# Altium project POVDisplay.PrjPcb
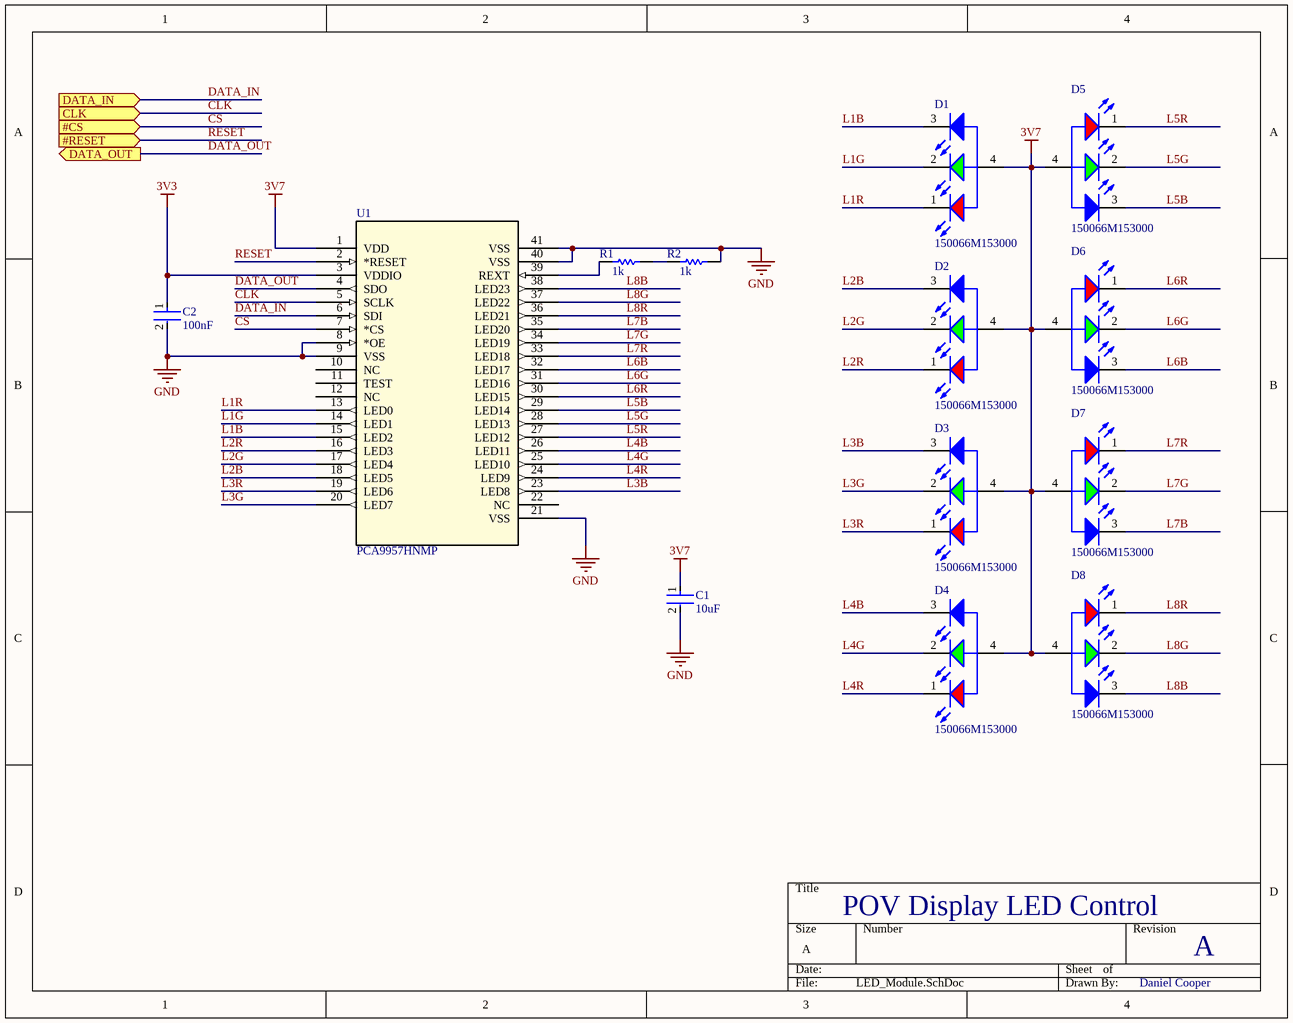
[diagram p0: LED_Module.SchDoc]
4 sheets, 53 parts. Net scope: hierarchical (ports join the sheet entries above them; power ports are global).
Board file: POVDisplay.PcbDoc
Sheets:
  LED_Module.SchDoc
  System.SchDoc
    MCU = MCU.SchDoc
    Power = Power.SchDoc

## Sheet LED_Module.SchDoc
size A; SheetNumber: 4; SheetTotal: 5

### Parts
(Parts that share a designator on the sheet are numbered #1, #2 ... from top to bottom, then left to right.)
C1#1  10uF  [FP-CL21-IPC_B]
C2#1  100nF  [FP-CL21-IPC_C]
D1  150066M153000  [WL-SFCD_0606]
D2  150066M153000  [WL-SFCD_0606]
D3  150066M153000  [WL-SFCD_0606]
D4  150066M153000  [WL-SFCD_0606]
D5  150066M153000  [WL-SFCD_0606]
D6  150066M153000  [WL-SFCD_0606]
D7  150066M153000  [WL-SFCD_0606]
D8  150066M153000  [WL-SFCD_0606]
R1#1  1k  [RESC2013X60X35ML10T20]
R2#1  1k  [RESC2013X60X35ML10T20]
U1  PCA9957HNMP  [HVQFN40_SOT1369-5_NXP]

### Ports
#CS (in), #RESET (in), CLK (in), DATA_IN (in), DATA_OUT (out)

### Nets
3V3: C2#1.1 U1.3(VDDIO)
3V7: C1#1.1 D1.4(A) D2.4(A) D3.4(A) D4.4(A) D5.4(A) D6.4(A) D7.4(A) D8.4(A) U1.1(VDD)
GND: C1#1.2 C2#1.2 R2#1.2 U1.8(*OE) U1.9(VSS) U1.21(VSS) U1.40(VSS) U1.41(VSS)
CLK: U1.5(SCLK) ; port CLK
CS: U1.7(*CS) ; port #CS
DATA_IN: U1.6(SDI) ; port DATA_IN
DATA_OUT: U1.4(SDO) ; port DATA_OUT
L1B: D1.3(K) U1.15(LED2)
L1G: D1.2(K) U1.14(LED1)
L1R: D1.1(K) U1.13(LED0)
L2B: D2.3(K) U1.18(LED5)
L2G: D2.2(K) U1.17(LED4)
L2R: D2.1(K) U1.16(LED3)
L3B: D3.3(K) U1.23(LED8)
L3G: D3.2(K) U1.20(LED7)
L3R: D3.1(K) U1.19(LED6)
L4B: D4.3(K) U1.26(LED11)
L4G: D4.2(K) U1.25(LED10)
L4R: D4.1(K) U1.24(LED9)
L5B: D5.3(K) U1.29(LED14)
L5G: D5.2(K) U1.28(LED13)
L5R: D5.1(K) U1.27(LED12)
L6B: D6.3(K) U1.32(LED17)
L6G: D6.2(K) U1.31(LED16)
L6R: D6.1(K) U1.30(LED15)
L7B: D7.3(K) U1.35(LED20)
L7G: D7.2(K) U1.34(LED19)
L7R: D7.1(K) U1.33(LED18)
L8B: D8.3(K) U1.38(LED23)
L8G: D8.2(K) U1.37(LED22)
L8R: D8.1(K) U1.36(LED21)
RESET: U1.2(*RESET) ; port #RESET
NetR1#1_1: R1#1.1 U1.39(REXT)
NetR1#1_2: R1#1.2 R2#1.1

Not connected (* = marked no-connect by the designer): U1 10(NC) 11(TEST) 12(NC) 22(NC)

### Notes on the sheet
- POV Display LED Control
- A
- Daniel Cooper

### Library data of the parts
C1#1 = CMP-2000-06102-2: CL21 Series 0805 10uF 16V ±10% Tolerance X5R Multilayer Ceramic Chip Capacitor; Dielectric: X7R; Length: 2mm; Depth: 1.25mm; Voltage: 16V; Width: 0.049inch; Capacitance: 10uF; Lead Free: Lead Free; Max Operating Temperature: 85°C; Mount: Surface Mount; Voltage Rating: 16V; Height: 1.25mm; Radiation Hardening: No; Packaging: Tape and Reel; Voltage Rating (DC): 16V; Thickness: 0.055inch; Case/Package: 0805; Case Code (Imperial): 0805; Min Operating Temperature: -55°C; Case Code (Metric): 2012; Package Quantity: 1; Tolerance: 10%
C2#1 = CMP-2000-05017-2: CL21 Series 0805 100nF 50V ±10% Tolerance X7R Multilayer Ceramic Chip Capacitor; Depth: 1.25mm; Height: 0.85mm; Width: 0.049inch; Tolerance: 10%; Case Code (Metric): 2012; Case Code (Imperial): 0805; Material: Ceramic; Thickness: 0.037inch; Min Operating Temperature: -55°C; Contact Plating: Tin; Length: 2mm; Mount: Surface Mount; Voltage Rating (DC): 50V; Lead Free: Lead Free; Dielectric: X7R; Radiation Hardening: No; Capacitance: 100nF; Voltage Rating: 50V; Case/Package: 0805; Packaging: Tape and Reel; Max Operating Temperature: 125°C; Voltage: 50V
D1-D8 = CMP-207942-000005-2: LED RGB DIFFUSED SMD; NexarPartId: 82270972; Peak Wavelength: 468nm; Reverse Voltage: 5V; Power Dissipation: 48mW; Forward Current: 40mA; Forward Voltage: 2V; Color: Blue, Green, Red; Viewing Angle: 120°; Dominant Wavelength: 525nm; Luminous Intensity: 180mcd; RoHS: Compliant; Width: 1.6mm; Min Operating Temperature: -40°C; Packaging: Tape and Reel; Max Operating Temperature: 85°C; Max Reverse Voltage (DC): 5V; Length: 1.6mm; Height: 400µm
R1#1 R2#1 = CMP-2100-03671-1: Chip Resistor, 1 KOhm, +/- 1%, 125 mW, -55 to 155 degC, 0805 (2012 Metric), RoHS, Tape and Reel; Manufacturer: Yageo; Temperature Coefficient: 100ppm/degreesC; Voltage Rating (DC): 150V; Max Power Dissipation: 125mW; Resistance: 1KOhm; Number of Pins: 2; Number of Terminations: 2; Datasheet URL: http://www.yageo.com/NewPortal/yageodocoutput?fileName=/pdf/R-Chip/PYu-RC_Group_51_RoHS_L_5.pdf; Length: 0.079inch; Package Description: 2-Pin Surface Mounted Device, Body 2 x 1.25 mm; Depth: 1.25mm; Height: 0.024inch; Military Standard: Not; Case/Package: 0805; Package Reference: 0805; RoHSCompliant: true; Lead Free: LeadFree; Packaging: TapeandReel; Package Quantity: 1; Datasheet Version: Rev. 5, 10/2016; Tolerance: 1%; Min Operating Temperature: -55degC; Voltage Rating: 150V; Composition: ThickFilm; Case Code (Imperial): 0805; Power Rating: 125mW; Width: 0.049inch; Case Code (Metric): 2012; Manufacturer URL: http://www.yageo.com/; Max Operating Temperature: 155degC; REACH SVHC: Unknown; Termination: SMD/SMT
U1 = PCA9957HNMP: No Description Available; Mfr_Name: NXP; RefDes: RefDes; Type: Type

## Sheet System.SchDoc
size A; SheetNumber: 1; SheetTotal: 5
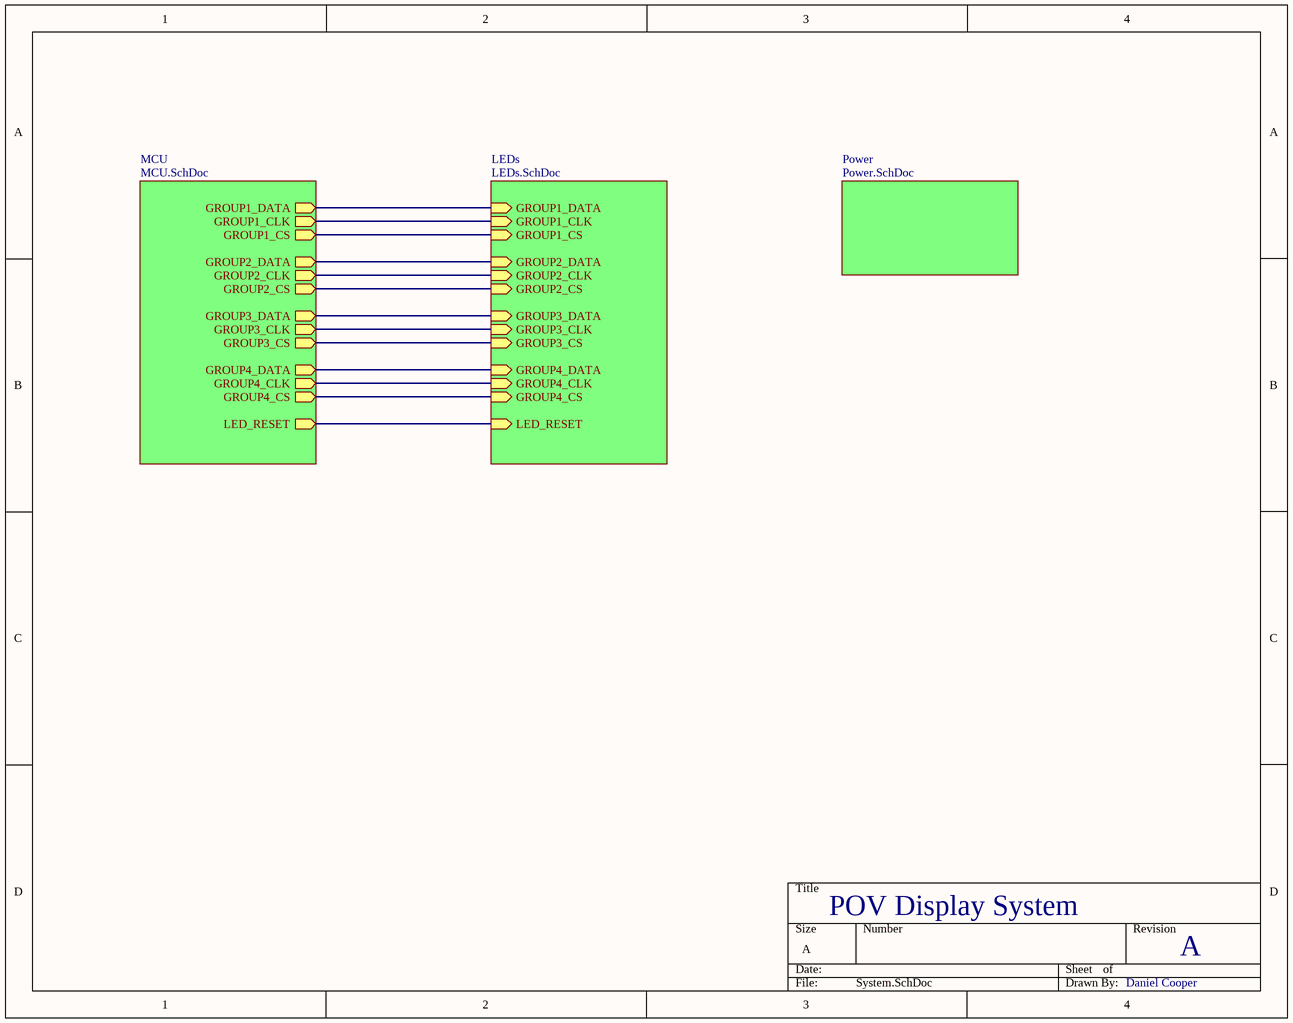
[diagram p1: System.SchDoc]

### Sub-sheets
LEDs = LEDs.SchDoc (file not in this document): LED_RESET (in), GROUP4_CS (in), GROUP4_CLK (in), GROUP4_DATA (in), GROUP3_CS (in), GROUP3_CLK (in), GROUP3_DATA (in), GROUP2_CS (in), GROUP2_CLK (in), GROUP2_DATA (in), GROUP1_CS (in), GROUP1_CLK (in), GROUP1_DATA (in)
MCU = MCU.SchDoc: GROUP1_DATA (out), GROUP1_CLK (out), GROUP1_CS (out), GROUP2_DATA (out), GROUP2_CLK (out), GROUP2_CS (out), GROUP3_DATA (out), GROUP3_CLK (out), GROUP3_CS (out), GROUP4_DATA (out), GROUP4_CLK (out), GROUP4_CS (out), LED_RESET (out)
Power = Power.SchDoc: no entries

### Nets
GROUP1_CLK: sheet MCU/GROUP1_CLK, sheet LEDs/GROUP1_CLK
GROUP1_CS: sheet MCU/GROUP1_CS, sheet LEDs/GROUP1_CS
GROUP1_DATA: sheet MCU/GROUP1_DATA, sheet LEDs/GROUP1_DATA
GROUP2_CLK: sheet MCU/GROUP2_CLK, sheet LEDs/GROUP2_CLK
GROUP2_CS: sheet MCU/GROUP2_CS, sheet LEDs/GROUP2_CS
GROUP2_DATA: sheet MCU/GROUP2_DATA, sheet LEDs/GROUP2_DATA
GROUP3_CLK: sheet MCU/GROUP3_CLK, sheet LEDs/GROUP3_CLK
GROUP3_CS: sheet MCU/GROUP3_CS, sheet LEDs/GROUP3_CS
GROUP3_DATA: sheet MCU/GROUP3_DATA, sheet LEDs/GROUP3_DATA
GROUP4_CLK: sheet MCU/GROUP4_CLK, sheet LEDs/GROUP4_CLK
GROUP4_CS: sheet MCU/GROUP4_CS, sheet LEDs/GROUP4_CS
GROUP4_DATA: sheet MCU/GROUP4_DATA, sheet LEDs/GROUP4_DATA
LED_RESET: sheet MCU/LED_RESET, sheet LEDs/LED_RESET

### Notes on the sheet
- POV Display System
- A
- Daniel Cooper

## Sheet MCU.SchDoc
size A; SheetNumber: 2; SheetTotal: 5
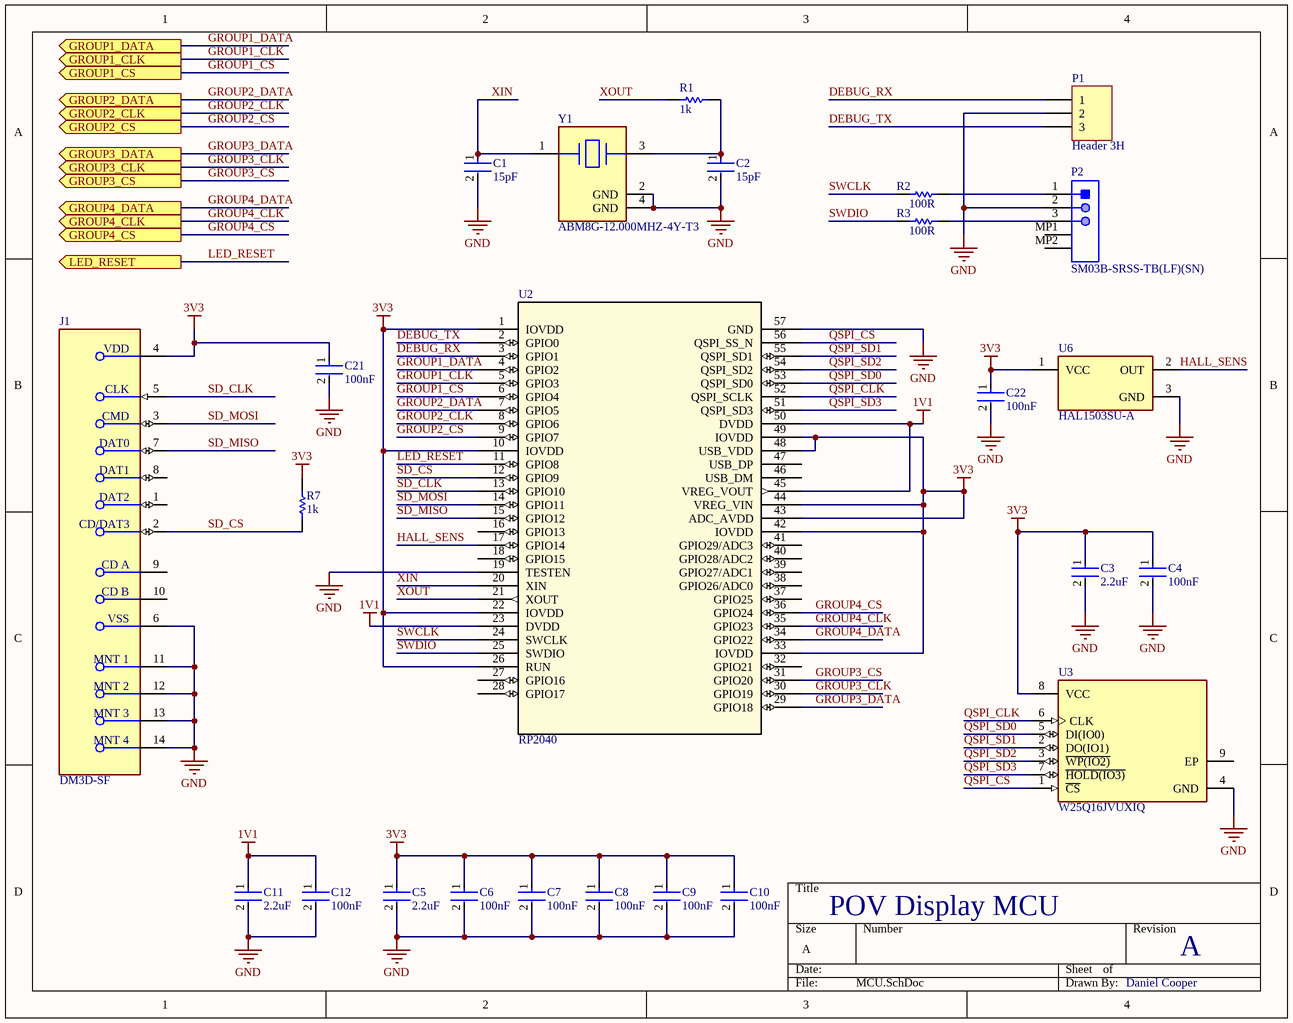
[diagram p2: MCU.SchDoc]

### Parts
(Parts that share a designator on the sheet are numbered #1, #2 ... from top to bottom, then left to right.)
C1#2  15pF  [FP-C0805C-DN-MFG]
C2#2  15pF  [FP-C0805C-DN-MFG]
C3  2.2uF  [FP-GRM21B-0_15-IPC_A]
C4  100nF  [FP-CL21-IPC_C]
C5  2.2uF  [FP-GRM21B-0_15-IPC_A]
C6  100nF  [FP-CL21-IPC_C]
C7  100nF  [FP-CL21-IPC_C]
C8  100nF  [FP-CL21-IPC_C]
C9  100nF  [FP-CL21-IPC_C]
C10  100nF  [FP-CL21-IPC_C]
C11  2.2uF  [FP-GRM21B-0_15-IPC_A]
C12  100nF  [FP-CL21-IPC_C]
C21  100nF  [FP-CL21-IPC_C]
C22  100nF  [FP-CL21-IPC_C]
J1  DM3D-SF  [FP-DM3D-SF-MFG]
P1  Header 3H  [HDR1X3H]
P2  SM03B-SRSS-TB(LF)(SN)  [JST-SM03B-SRSS-TB_V]
R1#2  1k  [RESC2013X60X35ML10T20]
R2#2  100R  [RESC2013X60X35ML10T20]
R3  100R  [RESC2013X60X35ML10T20]
R7  1k  [RESC2013X60X35ML10T20]
U2  RP2040  [IC57_RP2040]
U3  W25Q16JVUXIQ  [FP-UX-MFG]
U6  HAL1503SU-A  [FP-DBZ0003A-MFG]
Y1  ABM8G-12.000MHZ-4Y-T3  [FP-ABM8G-MFG]

### Ports
GROUP1_CLK (out), GROUP1_CS (out), GROUP1_DATA (out), GROUP2_CLK (out), GROUP2_CS (out), GROUP2_DATA (out), GROUP3_CLK (out), GROUP3_CS (out), GROUP3_DATA (out), GROUP4_CLK (out), GROUP4_CS (out), GROUP4_DATA (out), LED_RESET (out)

### Nets
1V1: C11.1 C12.1 U2.23(DVDD) U2.45(VREG_VOUT) U2.50(DVDD)
3V3: C3.1 C4.1 C5.1 C6.1 C7.1 C8.1 C9.1 C10.1 C21.1 C22.1 J1.4(VDD) R7.2 U2.1(IOVDD) U2.10(IOVDD) U2.22(IOVDD) U2.26(RUN) U2.33(IOVDD) U2.42(IOVDD) U2.43(ADC_AVDD) U2.44(VREG_VIN) U2.48(USB_VDD) U2.49(IOVDD) U3.8(VCC) U6.1(VCC)
GND: C1#2.2 C2#2.2 C3.2 C4.2 C5.2 C6.2 C7.2 C8.2 C9.2 C10.2 C11.2 C12.2 C21.2 C22.2 J1.6(VSS) J1.11(MNT_1) J1.12(MNT_2) J1.13(MNT_3) J1.14(MNT_4) P1.2 P2.2 U2.19(TESTEN) U2.57(GND) U3.4(GND) U6.3(GND) Y1.2(GND) Y1.4(GND)
DEBUG_RX: P1.1 U2.3(GPIO1)
DEBUG_TX: P1.3 U2.2(GPIO0)
GROUP1_CLK: U2.5(GPIO3) ; port GROUP1_CLK
GROUP1_CS: U2.6(GPIO4) ; port GROUP1_CS
GROUP1_DATA: U2.4(GPIO2) ; port GROUP1_DATA
GROUP2_CLK: U2.8(GPIO6) ; port GROUP2_CLK
GROUP2_CS: U2.9(GPIO7) ; port GROUP2_CS
GROUP2_DATA: U2.7(GPIO5) ; port GROUP2_DATA
GROUP3_CLK: U2.30(GPIO19) ; port GROUP3_CLK
GROUP3_CS: U2.31(GPIO20) ; port GROUP3_CS
GROUP3_DATA: U2.29(GPIO18) ; port GROUP3_DATA
GROUP4_CLK: U2.35(GPIO23) ; port GROUP4_CLK
GROUP4_CS: U2.36(GPIO24) ; port GROUP4_CS
GROUP4_DATA: U2.34(GPIO22) ; port GROUP4_DATA
HALL_SENS: U2.17(GPIO14) U6.2(OUT)
LED_RESET: U2.11(GPIO8) ; port LED_RESET
QSPI_CLK: U2.52(QSPI_SCLK) U3.6(CLK)
QSPI_CS: U2.56(QSPI_SS_N) U3.1(~{CS})
QSPI_SD0: U2.53(QSPI_SD0) U3.5(DI(IO0))
QSPI_SD1: U2.55(QSPI_SD1) U3.2(DO(IO1))
QSPI_SD2: U2.54(QSPI_SD2) U3.3(~{WP(IO2)})
QSPI_SD3: U2.51(QSPI_SD3) U3.7(~{HOLD(IO3)})
SD_CLK: J1.5(CLK) U2.13(GPIO10)
SD_CS: J1.2(CD/DAT3) R7.1 U2.12(GPIO9)
SD_MISO: J1.7(DAT0) U2.15(GPIO12)
SD_MOSI: J1.3(CMD) U2.14(GPIO11)
SWCLK: R2#2.1 U2.24(SWCLK)
SWDIO: R3.1 U2.25(SWDIO)
XIN: C1#2.1 U2.20(XIN) Y1.1
XOUT: R1#2.1 U2.21(XOUT)
NetC2#2_1: C2#2.1 R1#2.2 Y1.3
NetP2_1: P2.1 R2#2.2
NetP2_3: P2.3 R3.2

Not connected (* = marked no-connect by the designer): J1 1(DAT2) 8(DAT1) 9(CD_A) 10(CD_B); P2 MP1 MP2; U2 16(GPIO13) 18(GPIO15) 27(GPIO16) 28(GPIO17) 32(GPIO21) 37(GPIO25) 38(GPIO26/ADC0) 39(GPIO27/ADC1) 40(GPIO28/ADC2) 41(GPIO29/ADC3) 46(USB_DM) 47(USB_DP); U3 9(EP)

### Notes on the sheet
- POV Display MCU
- A
- Daniel Cooper

### Library data of the parts
C1#2 C2#2 = CMP-2007-00289-2: Cap Ceramic 15pF 50V C0G 5% SMD 0805 125C Plastic T/R; Manufacturer Part Number: C0805C150J5GACTU; Manufacturer: KEMET; Temperature Coefficient: 30ppm/°C; Tolerance: 0.05; Temperature Characteristic: C0G; Capacitance: 15 pF; Category: Cap; Voltage Rating: 50 V; Value: 15 pF; Lead Free: Yes; Material: Ceramic; Device Class L1: Passive Components; ComponentLink2Description: Datasheet; Temperature Range Low: -55°C; Ipc Land Pattern Name: CAPC200125X78; Automotive: No; Temperature: -55°C to +125°C; Digikey Description: Cap Ceramic 15pF 50V C0G 5% SMD 0805 125C Plastic T/R; Package: C0805C-DN; Temperature Range High: +125°C; Device Class L3: Ceramic Capacitors; Octopart: https://octopart.com/c0805c150j5gactu-kemet-97841; Height: 0.88mm; Mouser Description: Multilayer Ceramic Capacitors MLCC - SMD/SMT 50volts 15pF C0G 5%; ComponentLink2URL: https://content.kemet.com/datasheets/KEM_C1003_C0G_SMD.pdf; Device Class L2: Capacitors; RoHS: TRUE
C3 C5 C11 = CMP-06035-028354-1: Chip Multilayer Ceramic Capacitors for General Purpose, 0805, 2.2uF, X7R, 15%, 10%, 25V; Voltage Rating (DC): 25V; Thickness: 1.25mm; Dielectric: X7R; Tolerance: 10%; Length: 2mm; Width: 1.25mm; Capacitance: 2.2uF
C4 C6-C10 C12 C21 C22 = CMP-2000-05017-2: as C2#1 on sheet LED_Module; Depth: 1.25mm; Height: 0.85mm; Width: 0.049inch; Tolerance: 10%; Case Code (Metric): 2012; Case Code (Imperial): 0805; Material: Ceramic; Thickness: 0.037inch; Min Operating Temperature: -55°C; Contact Plating: Tin; Length: 2mm; Mount: Surface Mount; Voltage Rating (DC): 50V; Lead Free: Lead Free; Dielectric: X7R; Radiation Hardening: No; Capacitance: 100nF; Voltage Rating: 50V; Case/Package: 0805; Packaging: Tape and Reel; Max Operating Temperature: 125°C; Voltage: 50V
J1 = CMP-2000-06166-2: CONN MICRO SD CARD PUSH-PULL; Insulation Resistance: 1GR; Max Voltage Rating (AC): 125V; Gender: Female; Contact Resistance: 100mR; Current Rating: 500mA; Pitch: 1.1mm; Connector Type: Connector; Number of Contacts: 8; Contact Plating: Gold; Number of Rows: 1; Termination: Solder; Contact Material: Copper Alloy; REACH SVHC: No SVHC; Voltage Rating (AC): 125V; Packaging: Tape and Reel; Housing Material: Polymer; Max Operating Temperature: 85°C; Package Quantity: 1; Min Operating Temperature: -25°C; Lead Free: Lead Free; Orientation: Right Angle; Radiation Hardening: No; Flammability Rating: UL94 V-0; Mount: Surface Mount; Depth: 11.45mm; Max Current Rating: 500mA; Length: 11.95mm; Width: 11.95mm
P1 = Header 3H: Header, 3-Pin, Right Angle; LatestRevisionDate: 17-Jul-2002; LatestRevisionNote: Re-released for DXP Platform.; Publisher: Altium Limited
P2 = CMP-2000-07077-1: Male Header, Pitch 1 mm, 1 x 3 Position, Height 2.9 mm, -25 to 85 degC, RoHS, Tape and Reel; Manufacturer: JST; Pitch: 1mm; Style/Orientation: RightAngleHeader/Plug; No of Positions: 3; Package Description: Male Header, Pitch 1 mm, 1 x 3 Position, Height 2.9 mm; Manufacturer URL: http://www.jst.com/home2.html; Package Reference: SM03B-SRSS-TB; Type: ShroudedHeader; Termination: Crimp; Mounting Technology: SurfaceMount; Datasheet Version: 11/2010; Datasheet URL: https://datasheet.ciiva.com/26894/getdatasheetpartid-708885-26894671.pdf
R1#2 R7 = CMP-2100-03671-1: as R1#1 on sheet LED_Module; Number of Pins: 2; Number of Terminations: 2; Datasheet URL: http://www.yageo.com/NewPortal/yageodocoutput?fileName=/pdf/R-Chip/PYu-RC_Group_51_RoHS_L_5.pdf; Length: 0.079inch; Package Description: 2-Pin Surface Mounted Device, Body 2 x 1.25 mm; Depth: 1.25mm; Height: 0.024inch; Military Standard: Not; Case/Package: 0805; Package Reference: 0805; RoHSCompliant: true; Lead Free: LeadFree; Packaging: TapeandReel; Package Quantity: 1; Datasheet Version: Rev. 5, 10/2016; Tolerance: 1%; Min Operating Temperature: -55degC; Voltage Rating: 150V; Composition: ThickFilm; Case Code (Imperial): 0805; Power Rating: 125mW; Width: 0.049inch; Case Code (Metric): 2012; Manufacturer URL: http://www.yageo.com/; Max Operating Temperature: 155degC; REACH SVHC: Unknown; Termination: SMD/SMT
R2#2 R3 = CMP-2100-03669-1: Chip Resistor, 100 Ohm, +/-1%, 0.125 W, -55 to 155 degC, 0805 (2012 Metric), RoHS, Tape and Reel; Manufacturer: Yageo; Power Rating: 125mW; Resistance: 100Ohm; Voltage Rating: 150V; Tolerance: 1%; Temperature Coefficient: 100ppm/degreesC; Length: 2mm; Package Description: 2-Pin Surface Mounted Device, Body 2 x 1.25 mm; Case Code (Imperial): 0805; Number of Pins: 2; Termination: SMD/SMT; Lead Pitch: 0.4mm; Package Quantity: 1; Height: 0.024inch; Case Code (Metric): 2012; Number of Terminations: 2; Datasheet Version: Rev. 5, 10/2016; Lead Free: LeadFree; Package Reference: 0805; Composition: ThickFilm; REACH SVHC: Unknown; Voltage Rating (DC): 150V; Min Operating Temperature: -55degC; Packaging: TapeandReel; Military Standard: Not; Case/Package: 0805; Datasheet URL: http://www.yageo.com/NewPortal/yageodocoutput?fileName=/pdf/R-Chip/PYu-RC_Group_51_RoHS_L_5.pdf; Max Operating Temperature: 155degC; Manufacturer URL: http://www.yageo.com/; Max Power Dissipation: 125mW; Width: 0.049inch; Depth: 1.25mm; RoHSCompliant: true
U2 = RP2040: No Description Available; Mfr_Name: Raspberry Pi; RefDes: RefDes; Type: Type
U3 = CMP-78876-000011-1: IC FLASH 16MBIT SPI/QUAD 8USON; RoHS Compliant: Yes
U6 = CMP-04937-000003-1: LP HALL 32FBDBZR; Manufacturer Part Number: DRV5032FBDBZR; Manufacturer: Texas Instruments; Standoff Height: 0.01mm; Output Voltage: 5.5V; Max Junction Temp: +105°C; Output Current: 5mA; Sensor Output: Analog Voltage; Min Supply Voltage: 1.65V; Operating Supply Current: 1.06uA; Sensing Method: Hall Effect; Device Class L3: unset; Digikey Description: LP HALL 32FBDBZR; Ambient Temperature Range High: +85°C; Max Supply Voltage: 5.5V; Octopart: https://octopart.com/drv5032fbdbzr-texas+instruments-81717203; Lead Free: Yes; RoHS: TRUE; Mouser Description: Hall Effect Sensor 5mA Omnipolar 1.8V/2.5V/3.3V/5V 3-Pin SOT-23 T/R; ComponentLink2Description: Datasheet; Package: DBZ0003A; Device Class L2: Magnetic Sensors; Automotive: No; Temperature: -40°C to +85°C; Temperature Range Low: -40°C; Category: IC; Temperature Range High: +85°C; Device Class L1: Sensors; ComponentLink2URL: http://www.ti.com/lit/ds/symlink/drv5032.pdf; Ambient Temperature Range Low: -40°C; Height: 1.12mm
Y1 = CMP-27762-014577-1: Crystal 12MHz ±30ppm (Tol) ±30ppm (Stability) 10pF FUND 120Ω 4-Pin SMD T/R; ESR (Equivalent Series Resistance): 120R; Height: 0.039inch; Load Capacitance: 10pF; Operating Frequency: 12 MHz; REACH SVHC: No SVHC; Series: ABM8G; Series Resistance: 120R; Width: 0.098inch; Case/Package: CSMD; Min Operating Temperature: -10°C; Frequency: 12MHz; Mount: Surface Mount; Frequency Tolerance: 30ppm; Max Operating Temperature: 60°C; Lead Free: Lead Free; Frequency Stability: 30ppm; Depth: 2.5mm; Number of Pins: 4; Length: 3.2mm; Packaging: Tape and Reel

## Sheet Power.SchDoc
size A; SheetNumber: 5; SheetTotal: 5
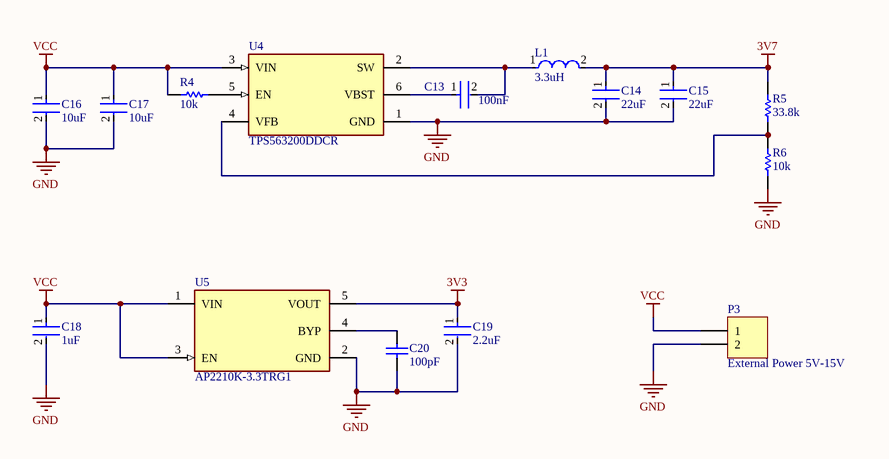
[diagram p3: Power.SchDoc]

### Parts
C13  100nF  [FP-CL21-IPC_C]
C14  22uF  [FP-CL21-IPC_A]
C15  22uF  [FP-CL21-IPC_A]
C16  10uF  [FP-CL21-IPC_B]
C17  10uF  [FP-CL21-IPC_B]
C18  1uF  [FP-CL21-IPC_C]
C19  2.2uF  [FP-GRM21B-0_15-IPC_A]
C20  100pF  [CAPC2013X145X48NL20T23]
L1  3.3uH  [FP-SRP4020TA-MFG]
P3  External Power 5V-15V  [HDR1X2]
R4  10k  [RESC2013X60X35NL10T20]
R5  33.8k  [RESC2013X60X35ML10T20]
R6  10k  [RESC2013X60X35NL10T20]
U4  TPS563200DDCR  [FP-DDC0006A-MFG]
U5  AP2210K-3.3TRG1  [FP-SOT25-MFG]

### Nets
3V3: C19.1 U5.5(VOUT)
3V7: C14.1 C15.1 L1.2 R5.2
GND: C14.2 C15.2 C16.2 C17.2 C18.2 C19.2 C20.1 P3.2 R6.1 U4.1(GND) U5.2(GND)
VCC: C16.1 C17.1 C18.1 P3.1 R4.1 U4.3(VIN) U5.1(VIN) U5.3(EN)
NetC13_1: C13.1 U4.6(VBST)
NetC13_2: C13.2 L1.1 U4.2(SW)
NetC20_2: C20.2 U5.4(BYP)
NetR4_2: R4.2 U4.5(EN)
NetR5_1: R5.1 R6.2 U4.4(VFB)

### Library data of the parts
C13 = CMP-2000-05017-2: as C2#1 on sheet LED_Module; Depth: 1.25mm; Height: 0.85mm; Width: 0.049inch; Tolerance: 10%; Case Code (Metric): 2012; Case Code (Imperial): 0805; Material: Ceramic; Thickness: 0.037inch; Min Operating Temperature: -55°C; Contact Plating: Tin; Length: 2mm; Mount: Surface Mount; Voltage Rating (DC): 50V; Lead Free: Lead Free; Dielectric: X7R; Radiation Hardening: No; Capacitance: 100nF; Voltage Rating: 50V; Case/Package: 0805; Packaging: Tape and Reel; Max Operating Temperature: 125°C; Voltage: 50V
C14 C15 = CMP-13271-000185-1: CL21 Series 0805 22uF 6.3V ±20% Tolerance X5R Multilayer Ceramic Chip Capacitor; Height: 1.25mm; Length: 2mm; Capacitance: 22uF; Mount: Surface Mount; Dielectric: X5R; Voltage Rating (DC): 6.3V; Case Code (Metric): 2012; Depth: 1.25mm; Max Operating Temperature: 85°C; Voltage Rating: 6.3V; Width: 0.049inch; Case/Package: 0805; Radiation Hardening: No; Thickness: 0.055inch; Packaging: Tape and Reel; Package Quantity: 2000; Lead Free: Lead Free; Contact Plating: Tin; Min Operating Temperature: -55°C; Case Code (Imperial): 0805; Tolerance: 20%
C16 C17 = CMP-2000-06102-2: as C1#1 on sheet LED_Module; Length: 2mm; Depth: 1.25mm; Voltage: 16V; Width: 0.049inch; Capacitance: 10uF; Lead Free: Lead Free; Max Operating Temperature: 85°C; Mount: Surface Mount; Voltage Rating: 16V; Height: 1.25mm; Radiation Hardening: No; Packaging: Tape and Reel; Voltage Rating (DC): 16V; Thickness: 0.055inch; Case/Package: 0805; Case Code (Imperial): 0805; Min Operating Temperature: -55°C; Case Code (Metric): 2012; Package Quantity: 1; Tolerance: 10%
C18 = CMP-13271-004196-1: CL21 Series 0805 1uF 50V ±10% Tolerance X7R Multilayer Ceramic Chip Capacitor; Tolerance: 10%; Thickness: 0.053inch; Case/Package: 0805; Mount: Surface Mount; Depth: 1.25mm; Radiation Hardening: No; Voltage Rating: 50V; Max Operating Temperature: 125°C; Case Code (Imperial): 0805; Min Operating Temperature: -55°C; Length: 0.079inch; Dielectric: X7R; Case Code (Metric): 2012; Packaging: Tape and Reel; Width: 0.049inch; Package Quantity: 1; Capacitance: 1uF; Height: 1.25mm
C19 = CMP-06035-028354-1: as C3 on sheet MCU; Voltage Rating (DC): 25V; Thickness: 1.25mm; Dielectric: X7R; Tolerance: 10%; Length: 2mm; Width: 1.25mm; Capacitance: 2.2uF
C20 = CMP-2007-03018-1: Part Number: VJ0805A101JXGAT5Z; Manufacturer: Vitramon
L1 = CMP-07248-000008-1: FIXED IND 3.3UH 3.5A 76 MOHM SMD; Manufacturer: Bourns; Manufacturer Part Number: SRP4020TA-3R3M; Shielding: true; Test Frequency: 100kHz; Self Resonant Frequency: 40MHz; Saturation Current: 4A; Q Factor: 10; Series Resistance: 76mΩ; Automotive Grade: Grade 0; Core Material: Carbonyl Powder; Tolerance: 20%; Temperature Range High: +150°C; Height: 2.1mm; Temperature: -40°C to +150°C; RoHS: TRUE; Device Class L3: Fixed Inductors; Automotive: Yes; Octopart: https://octopart.com/srp4020ta-3r3m-bourns-47300338; Composition: Wirewound; Mouser Description: Ind Power Shielded Wirewound 3.3uH 20% 100KHz Carbonyl Powder 3.5A T/R; Category: Ind; ComponentLink2Description: Datasheet; ComponentLink2URL: https://www.bourns.com/docs/Product-Datasheets/SRP4020TA.pdf; Digikey Description: FIXED IND 3.3UH 3.5A 76 MOHM SMD; Lead Free: Yes; Temperature Range Low: -40°C; Inductance: 3.3uH; Rms Current: 3.5A; Package: SRP4020TA; Value: 3.3uH; Device Class L1: Passive Components; Device Class L2: Inductors
P3 = Header 2: Header, 2-Pin; LatestRevisionDate: 17-Jul-2002; LatestRevisionNote: Re-released for DXP Platform.; Publisher: Altium Limited
R4 R6 = CMP-1659-00013-4: Chip Resistor, 10 KOhm, +/- 1%, 0.125 W, -55 to 155 degC, 0805 (2012 Metric), RoHS, Tape and Reel; Manufacturer: Yageo; Voltage Rating: 150 V; Mount: Surface Mount; ComponentLink1Description: Manufacturer URL; ComponentLink2URL: http://www.yageo.com/documents/recent/PYu-RC_Group_51_RoHS_L_04.pdf; Pins: 2; Length: 2 mm; Min Operating Temperature: -55 degC; Height: 0.5 mm; Mounting Technology: Surface Mount; RoHSCompliant: true; REACH SVHC: No SVHC; ComponentLink1URL: http://www.yageo.com/; Max Operating Temperature: 155 degC; PackageReference: 0805; DatasheetVersion: Rev. 4, 02/2016; Package Quantity: 5000; Packaging: Tape and Reel; ComponentLink2Description: Datasheet; PackageDescription: 2-Pin Surface Mounted Device, Body 2 x 1.25 mm
R5 = CMP-2001-01109-1: Manufacturer: Yageo; Part Number: RC0805FR-0738K3L
U4 = CMP-04918-000155-1: IC REG BUCK ADJ 3A TSOT23-6; Quiescent Current: 190uA; Output Voltage: 7V; Min Input Voltage: 4.5V; Output Configuration: Positive; Number of Outputs: 1; Switching Frequency: 650kHz; Synchronous Rectifier: Yes; Min Output Voltage: 760mV; Output Type: Adjustable; Operating Supply Voltage: 17V; Max Operating Temperature: 125°C; Lead Free: Lead Free; Packaging: Tape and Reel; Radiation Hardening: No; Mount: Surface Mount; Contact Plating: Tin; Output Current: 3A; Max Output Voltage: 7V; Min Operating Temperature: -40°C; Case/Package: SOT-23-6; Max Output Current: 3A; Max Input Voltage: 17V
U5 = CMP-12756-000023-1: IC REG LINEAR 3.3V 300MA SOT23-5; Manufacturer: Diodes; Number Of Outputs: 1; Max Supply Voltage: 13.2V; Max Junction Temp: +125°C; Accuracy Percentage: 1%; Nominal Supply Current: 0.01uA; Output Type: Fixed; Min Supply Voltage: 2.5V; Dropout Voltage: 250mV; Standoff Height: 0.013mm; Temperature: -40°C to +85°C; Temperature Range High: +85°C; Device Class L3: Voltage Regulators - Linear; Package: SOT25; ComponentLink2Description: Datasheet; ComponentLink2URL: https://www.diodes.com/assets/Datasheets/AP2210.pdf; Digikey Description: IC REG LINEAR 3.3V 300MA SOT23-5; Height: 1.4mm; Lead Free: Yes; Footprint Url: https://www.diodes.com/assets/Package-Files/SOT25.pdf; Mouser Description: LDO Voltage Regulators 300mA CMOS LDO 3.3V 250mV; Output Current: 300mA; Output Voltage: 3.3V; Category: IC; Octopart: https://octopart.com/ap2210k-3.3trg1-diodes+inc.-30954630; RoHS: TRUE; Device Class L1: Integrated Circuits (ICs); Temperature Range Low: -40°C; Device Class L2: Power Management ICs; Automotive: No; Manufacturer Part Number: AP2210K-3.3TRG1

## Nets that join several sheets
3V3: LED_Module (C2#1.1 U1.3), MCU (24 pins), Power (C19.1 U5.5)
3V7: LED_Module (10 pins), Power (C14.1 C15.1 L1.2 R5.2)
GND: LED_Module (8 pins), MCU (27 pins), Power (11 pins)